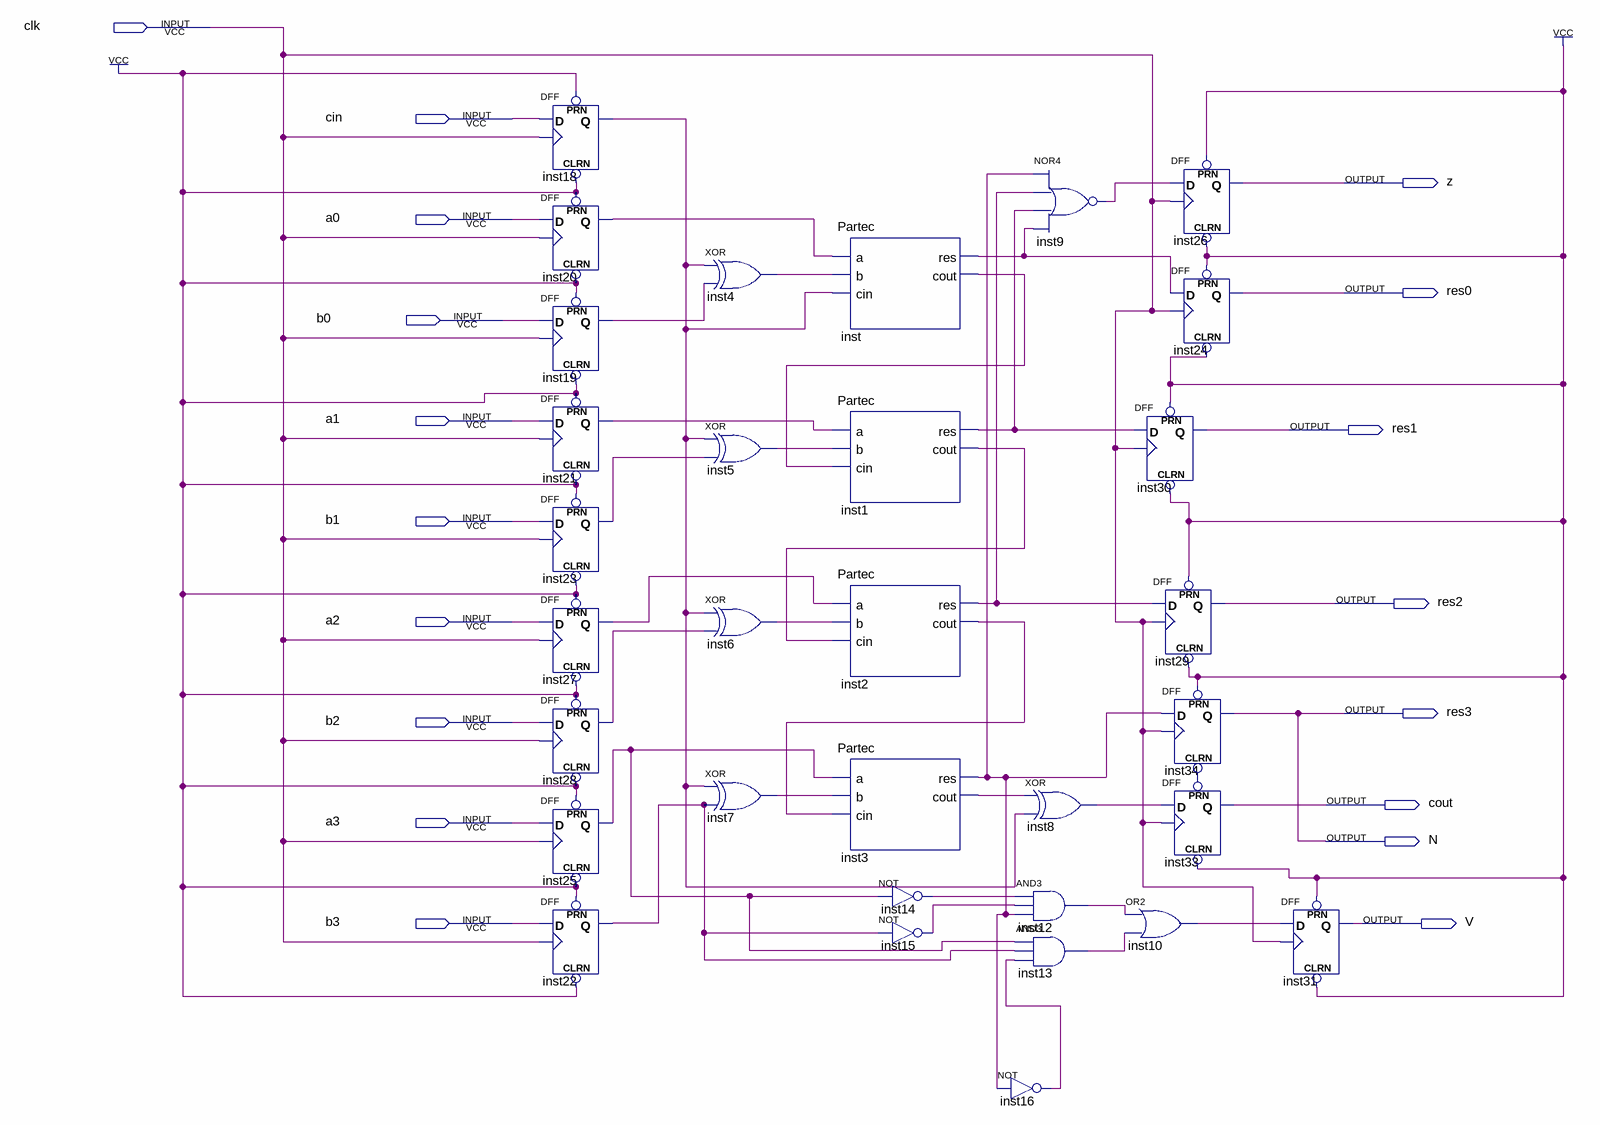
[diagram p0: schematic sheet]
// Quartus schematic Block1.bdf as structural Verilog: 32 symbols, 18 pins
module Block1 (
  input  clk,
  input  cin,
  input  a0,
  input  b0,
  input  a1,
  input  b1,
  input  a2,
  input  b2,
  input  a3,
  input  b3,
  output z,
  output res0,
  output res1,
  output res2,
  output res3,
  output cout,
  output N,
  output V
);

  wire inst1_cout, inst1_res, inst2_cout, inst2_res, inst3_cout, inst3_res, inst4_out, inst5_out, inst6_out,
       inst7_out, inst8_out, inst9_out, inst10_out, inst12_out, inst13_out, inst14_out, inst15_out,
       inst16_out, inst18_q, inst19_q, inst20_q, inst21_q, inst22_q, inst23_q, inst25_q, inst27_q, inst28_q,
       inst_cout, inst_res, undriven;

  DFF inst18 (.CLRN(1'b1), .CLK(clk), .D(cin), .PRN(1'b1), .Q(inst18_q));
  DFF inst20 (.CLRN(1'b1), .CLK(clk), .D(a0), .PRN(1'b1), .Q(inst20_q));
  DFF inst19 (.CLRN(1'b1), .CLK(clk), .D(b0), .PRN(1'b1), .Q(inst19_q));
  DFF inst21 (.CLRN(1'b1), .CLK(clk), .D(a1), .PRN(1'b1), .Q(inst21_q));
  DFF inst23 (.CLRN(1'b1), .CLK(clk), .D(b1), .PRN(1'b1), .Q(inst23_q));
  DFF inst27 (.CLRN(1'b1), .CLK(clk), .D(a2), .PRN(1'b1), .Q(inst27_q));
  DFF inst28 (.CLRN(1'b1), .CLK(clk), .D(b2), .PRN(1'b1), .Q(inst28_q));
  DFF inst25 (.CLRN(1'b1), .CLK(clk), .D(a3), .PRN(1'b1), .Q(inst25_q));
  DFF inst22 (.CLRN(1'b1), .CLK(clk), .D(b3), .PRN(1'b1), .Q(inst22_q));
  xor inst4 (inst4_out, inst18_q, inst19_q);
  xor inst5 (inst5_out, inst18_q, inst23_q);
  xor inst6 (inst6_out, inst18_q, inst28_q);
  xor inst7 (inst7_out, inst18_q, inst22_q);
  Partec inst (.a(inst20_q), .b(inst4_out), .cin(inst18_q), .res(inst_res), .cout(inst_cout));
  Partec inst1 (.a(inst21_q), .b(inst5_out), .cin(inst_cout), .res(inst1_res), .cout(inst1_cout));
  Partec inst2 (.a(inst27_q), .b(inst6_out), .cin(inst1_cout), .res(inst2_res), .cout(inst2_cout));
  Partec inst3 (.a(inst25_q), .b(inst7_out), .cin(inst2_cout), .res(inst3_res), .cout(inst3_cout));
  not inst14 (inst14_out, inst25_q);
  not inst15 (inst15_out, inst22_q);
  nor inst9 (inst9_out, inst3_res, inst2_res, inst1_res, inst_res);
  xor inst8 (inst8_out, inst3_cout, inst18_q);
  and inst12 (inst12_out, inst14_out, inst15_out, inst3_res);
  and inst13 (inst13_out, inst25_q, inst22_q, inst16_out);
  not inst16 (inst16_out, inst3_res);
  or inst10 (inst10_out, inst12_out, inst13_out);
  DFF inst26 (.CLRN(1'b1), .CLK(clk), .D(inst9_out), .PRN(1'b1), .Q(z));
  DFF inst24 (.CLRN(1'b1), .CLK(clk), .D(inst_res), .PRN(1'b1), .Q(res0));
  DFF inst30 (.CLRN(1'b1), .CLK(clk), .D(inst1_res), .PRN(1'b1), .Q(res1));
  DFF inst29 (.CLRN(1'b1), .CLK(clk), .D(inst2_res), .PRN(1'b1), .Q(res2));
  DFF inst34 (.CLRN(undriven), .CLK(clk), .D(inst3_res), .PRN(1'b1), .Q(N));
  DFF inst33 (.CLRN(1'b1), .CLK(clk), .D(inst8_out), .PRN(undriven), .Q(cout));
  DFF inst31 (.CLRN(1'b1), .CLK(clk), .D(inst10_out), .PRN(1'b1), .Q(V));

  assign res3 = N;
endmodule
